# EAGLE schematic ll3-b1 (EAGLE 5.10)
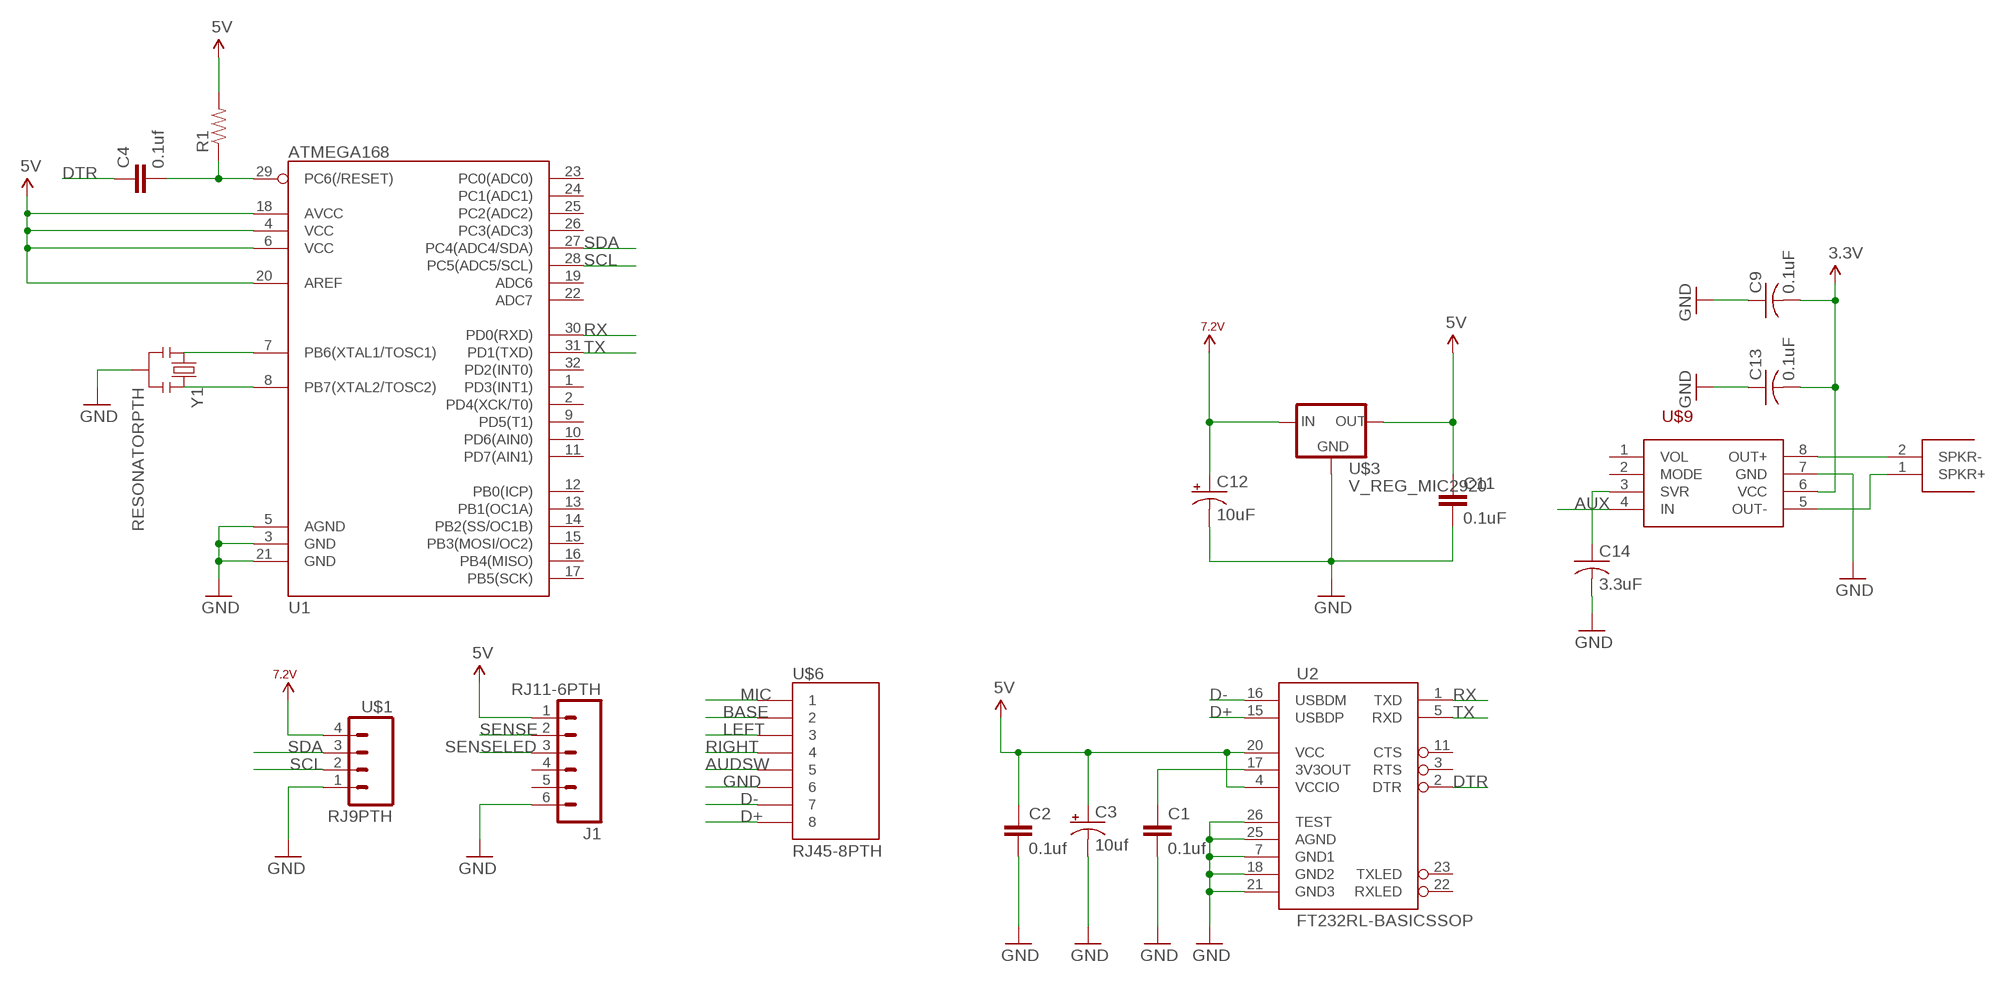
[diagram p0: schematic, sheet 1]

## Parts
C1  0.1uf  CAP0603-CAP  [0603-CAP]
C2  0.1uf  CAP0603-CAP  [0603-CAP]
C3  10uf  CAP_POL1206  [EIA3216]
C4  0.1uf  CAP0603-CAP  [0603-CAP]
C9  0.1uF  C-USC0603  [C0603]
C11  0.1uF  CAP0805  [0805]
C12  10uF  CAP_POL1206  [EIA3216]
C13  0.1uF  C-USC0603  [C0603]
C14  3.3uF  C-USC0603  [C0603]
J1  RJ11-6PTH  [RJ11-6]
R1  RESISTOR  [0805]
U1  ATMEGA168  [TQFP32-08]
U2  FT232RL-BASICSSOP  [SSOP28DB]
U$1  RJ9PTH  [RJ9]
U$3  V_REG_MIC2920  [SOT223]
U$6  RJ45-8PTH  [RJ45-8]
U$8  SPKRHEAD  [SPKRHEAD]
U$9  TDA8551T  [SO08]
Y1  RESONATORPTH  [RESONATOR-PTH]

## Nets
3.3V: C9.2 C13.2 U$9.6(VCC)
5V: C2.1 C3.A(+) C11.1 J1.1 R1.2 U1.4(VCC) U1.6(VCC) U1.18(AVCC) U1.20(AREF) U2.4(VCCIO) U2.20(VCC) U$3.3(OUT)
7.2V: C12.A(+) U$1.4 U$3.1(IN)
AUDSW: U$6.5
AUX: U$9.4(IN)
BASE: U$6.2
D+: U2.15(USBDP) U$6.8
D-: U2.16(USBDM) U$6.7
DTR: C4.1 U2.2(DTR)
GND: C1.2 C2.2 C3.C(-) C9.1 C11.2 C12.C(-) C13.1 C14.2 J1.6 U1.3(GND) U1.5(AGND) U1.21(GND) U2.7(GND1) U2.18(GND2) U2.21(GND3) U2.25(AGND) U2.26(TEST) U$1.1 U$3.2(GND) U$6.6 U$9.7(GND) Y1.2
LEFT: U$6.3
MIC: U$6.1
N$1: U1.7(PB6(XTAL1/TOSC1)) Y1.1
N$2: U1.8(PB7(XTAL2/TOSC2)) Y1.3
N$3: C1.1 U2.17(3V3OUT)
N$9: U$8.1(SPKR+) U$9.5(OUT-)
N$10: U$8.2(SPKR-) U$9.8(OUT+)
N$30: C14.1 U$9.3(SVR)
RIGHT: U$6.4
RST: C4.2 R1.1 U1.29(PC6(/RESET))
RX: U1.30(PD0(RXD)) U2.1(TXD)
SCL: U1.28(PC5(ADC5/SCL)) U$1.2
SDA: U1.27(PC4(ADC4/SDA)) U$1.3
SENSE: J1.2
SENSELED: J1.3
TX: U1.31(PD1(TXD)) U2.5(RXD)
Unconnected: J1.4 J1.5 U1.1(PD3(INT1)) U1.2(PD4(XCK/T0)) U1.9(PD5(T1)) U1.10(PD6(AIN0)) U1.11(PD7(AIN1)) U1.12(PB0(ICP)) U1.13(PB1(OC1A)) U1.14(PB2(SS/OC1B)) U1.15(PB3(MOSI/OC2)) U1.16(PB4(MISO)) U1.17(PB5(SCK)) U1.19(ADC6) U1.22(ADC7) U1.23(PC0(ADC0)) U1.24(PC1(ADC1)) U1.25(PC2(ADC2)) U1.26(PC3(ADC3)) U1.32(PD2(INT0)) U2.3(RTS) U2.11(CTS) U2.22(RXLED) U2.23(TXLED) U$9.1(VOL) U$9.2(MODE)

## Library data of the parts
C1 C2 C4 C11 = sparkfun:CAP: Capacitor Standard 0603 ceramic capacitor, and 0.1" leaded capacitor.
C3 C12 = sparkfun:CAP_POL: Capacitor Polarized These are standard SMD and PTH capacitors. Normally 10uF, 47uF, and 100uF in electrolytic and tantalum varieties. Always verify the external diameter of the through hole cap, it varies with capacity, voltage, and manufacturer. The EIA devices should be standard.
C9 C13 C14 = rcl:C-US: CAPACITOR, American symbol
J1 = sparkfun:RJ11-6: RJ11 Jack Simple 6 pin RJ11 jack. Commonly found on CAT3 devices and Microchip programmers. SKU: PRT-00132
R1 = sparkfun:RESISTOR: Resistor Basic schematic elements and footprints for 0603, 1206, and PTH 1/10th watt (small) resistors.
U1 = sparkfun:ATMEGA168
U2 = sparkfun:FT232RL-BASIC: USB UART This is the simplified version of the FT232RL unit. Only what you need, nothing you don't. Spark Fun Electronics SKU : COM-00650
U$1 = sparkfun:RJ9
U$3 = sparkfun:V_REG_MIC2920: MIC2920A (http://www.micrel.com/_PDF/mic2920.pdf) - 400mA output LDO Regulator
U$6 = sparkfun:RJ45-8: RJ45 Jack Simple RJ45, 8-pin connection - connector for common Cat5, Cat5e, and Cat6 Ethernet cables. Footprint not yet proven in production. Connector sku is PRT-00643; Breakout PCB sku is BOB-00716.
U$8 = custom:SPKRHEAD
U$9 = custom:TDA8551T
Y1 = sparkfun:RESONATOR: Resonator Small SMD resonator. This is the itty bitty 10/20MHz resonators with built in caps. CSTCE10M0G55 and CSTCE20M0V53. Footprint has been reviewed closely but hasn't been tested yet.